# Altium project CWRUMagEncoder.PrjPcb
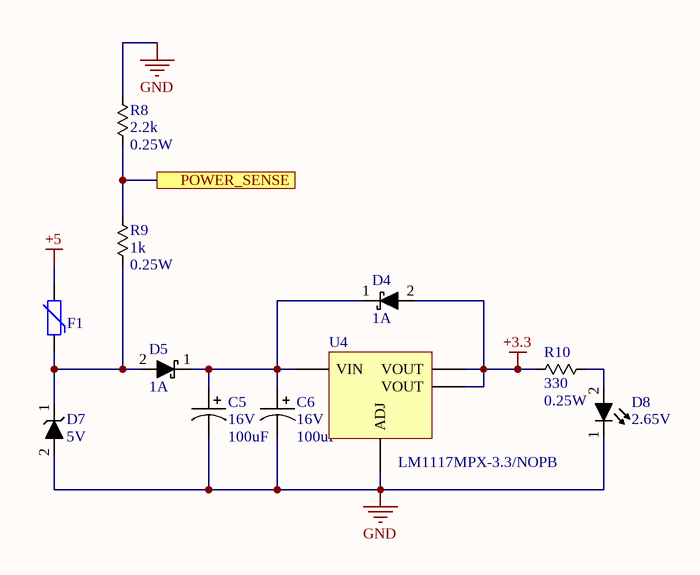
[diagram p0: Power.SchDoc]
4 sheets, 45 parts. Net scope: flat (ports and power ports of the same name join across sheets).
Board file: Board.PcbDoc
Sheets:
  Power.SchDoc
  IO.SchDoc
  Encoder.SchDoc
  MCU.SchDoc

## Sheet Power.SchDoc
size A

### Parts
C5  Voltage Rating: 16V  Capacitance: 100uF  [chip_2917_AVX_TAJD]  (hidden comment: cap_single_p)
C6  Voltage Rating: 16V  Capacitance: 100uF  [chip_2917_AVX_TAJD]  (hidden comment: cap_single_p)
D4  Current Rating: 1A  [sod123_0]  (hidden comment: diode_2)
D5  Current Rating: 1A  [sod123_0]  (hidden comment: diode_2)
D7  Reverse Breakdown Voltage: 5V  [do-214ac]  (hidden comment: diode_1)
D8  Forward Voltage: 2.65V  [chip_0603]  (hidden comment: diode_4)
F1  PTC_0  [chip_1206]  (value not drawn)
R8  Resistance: 2.2k  Power Rating: 0.25W  [chip_0603]  (hidden comment: res_single)
R9  Resistance: 1k  Power Rating: 0.25W  [chip_0603]  (hidden comment: res_single)
R10  Resistance: 330  Power Rating: 0.25W  [chip_0603]  (hidden comment: res_single)
U4  Manufacturer PN: LM1117MPX-3.3/NOPB  [sot-223-4]  (hidden comment: LM1117)

### Ports
POWER_SENSE

### Nets
+3.3: D4.2 R10.1 U4.2(VOUT) U4.4(VOUT)
+5: F1.2
GND: C5.2 C6.2 D7.2 D8.1 R8.1 U4.1(ADJ)
NetC5_1: C5.1 C6.1 D4.1 D5.1 U4.3(VIN)
NetD5_2: D5.2 D7.1 F1.1 R9.2
NetD8_2: D8.2 R10.2
NetR8_2: R8.2 R9.1 ; port POWER_SENSE

### Library data of the parts
C5 C6 = CAP-00550: CAP, 100uF, ±10%, 16V, Tantalum, 2917; Manufacturer: AVX; Manufacturer PN: TAJD107K016RNJ; Tolerance: ±10%; Part Number: CAP-00550; Type: Tantalum; Cost: $0.94
D4 D5 = DIO-00001: Dio Shtky, 1A, 0.55V, 40V, SOD-123; Manufacturer: ON Semi; Manufacturer PN: MBR140SFT1G; Forward Voltage: 550mV; Type: Schottky; Reverse Breakdown Voltage: 40V; Part Number: DIO-00001
D7 = DIO-00036: TVS, 5V, 400W, Unidirectional; Manufacturer: ST; Manufacturer PN: SMAJ5.0A-TR; Type: TVS; Part Number: DIO-00036; Power Rating: 400W; Cost: 0.48
D8 = DIO-00050: LED, Green, 0603, Low current, HELI2 Series; Manufacturer: Kingbright; Manufacturer PN: APT1608LZGCK; Reverse Breakdown Voltage: 5V; Current Rating: 30mA; Power Rating: 120mW; Type: LED; Part Number: DIO-00050; Cost: 0.58
F1 = MISC-00008: PTC Resettable fuse, 6V, 500mA, 1206; Manufacturer: Eaton; Manufacturer PN: PTS12066V050; TEMP_CO: *; Part Number: MISC-00008; Cost: 0.3
R8 = RES-00365: RES SMD 2.2K OHM 1% 1/4W 0603; Manufacturer: Panasonic; Manufacturer PN: ERJ-PA3F2201V; Tolerance: 1%; Part Number: RES-00365
R9 = RES-00360: RES SMD 1K OHM 1% 1/4W 0603; Manufacturer: Panasonic; Manufacturer PN: ERJ-PA3F1001V; Tolerance: 1%; Part Number: RES-00360
R10 = RES-00221: RES SMD 330 OHM 1% 1/4W 0603; Manufacturer: Panasonic; Manufacturer PN: ERJ-PA3F3300V; Tolerance: 1%; Part Number: RES-00221
U4 = PWREG-00018: REG, Linear, Fixed 3V3, 800mA, SOT-223; Manufacturer: TI; Voltage Range In: 4.5 - 15V; Voltage Range Out: 3.3V; Part Number: PWREG-00018; Max Current: 800mA; Reg Type: Linear; Fixed/Adj: Fixed; Cost: 1.14

## Sheet IO.SchDoc
size A
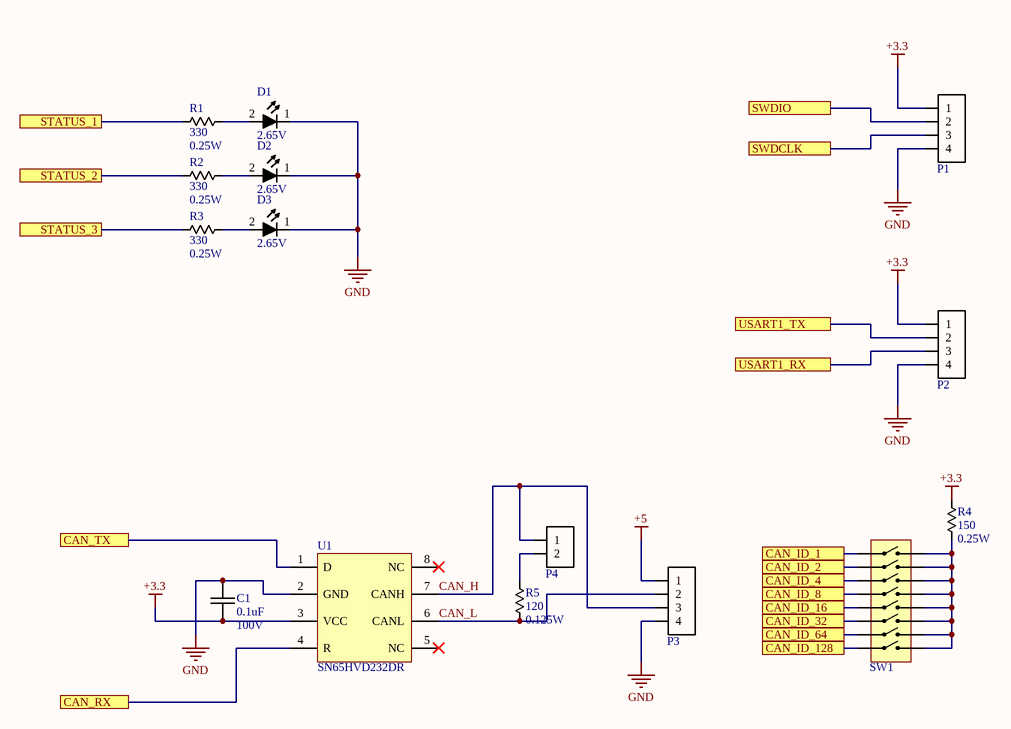
[diagram p1: IO.SchDoc]

### Parts
C1  Capacitance: 0.1uF  Voltage Rating: 100V  [chip_0603]  (hidden comment: cap_single_np)
D1  Forward Voltage: 2.65V  [chip_0603]  (hidden comment: diode_4)
D2  Forward Voltage: 2.65V  [chip_0603]  (hidden comment: diode_4)
D3  Forward Voltage: 2.65V  [chip_0603]  (hidden comment: diode_4)
P1  conn-4x1_0  [HDDR_4x1_0]  (value not drawn)
P2  conn-4x1_0  [HDDR_4x1_0]  (value not drawn)
P3  conn-4x1_0  [TERM_3.50MM_4x1_0]  (value not drawn)
P4  conn-2x1_0  [hddr_2x1_0]  (value not drawn)
R1  Resistance: 330  Power Rating: 0.25W  [chip_0603]  (hidden comment: res_single)
R2  Resistance: 330  Power Rating: 0.25W  [chip_0603]  (hidden comment: res_single)
R3  Resistance: 330  Power Rating: 0.25W  [chip_0603]  (hidden comment: res_single)
R4  Resistance: 150  Power Rating: 0.25W  [chip_0603]  (hidden comment: res_single)
R5  Resistance: 120  Power Rating: 0.125W  [chip_0805]  (hidden comment: res_single)
SW1  DIP_SW_8  [A6S-8104-H]  (value not drawn)
U1  Manufacturer PN: SN65HVD232DR  [SO-8]  (hidden comment: SN65HVD232)

### Ports
CAN_ID_1, CAN_ID_2, CAN_ID_4, CAN_ID_8, CAN_ID_16, CAN_ID_32, CAN_ID_64, CAN_ID_128, CAN_RX, CAN_TX, STATUS_1, STATUS_2, STATUS_3, SWDCLK, SWDIO, USART1_RX, USART1_TX

### Nets
+3.3: C1.2 P1.1 P2.1 R4.2 U1.3(VCC)
+5: P3.1
GND: C1.1 D1.1 D2.1 D3.1 P1.4 P2.4 P3.4 U1.2(GND)
CAN_H: P3.3 P4.1 U1.7(CANH)
CAN_L: P3.2 R5.2 U1.6(CANL)
NetD1_2: D1.2 R1.2
NetD2_2: D2.2 R2.2
NetD3_2: D3.2 R3.2
NetP1_2: P1.2 ; port SWDIO
NetP1_3: P1.3 ; port SWDCLK
NetP2_2: P2.2 ; port USART1_TX
NetP2_3: P2.3 ; port USART1_RX
NetP4_2: P4.2 R5.1
NetR1_1: R1.1 ; port STATUS_1
NetR2_1: R2.1 ; port STATUS_2
NetR3_1: R3.1 ; port STATUS_3
NetR4_1: R4.1 SW1.9 SW1.10 SW1.11 SW1.12 SW1.13 SW1.14 SW1.15 SW1.16
NetSW1_1: SW1.1 ; port CAN_ID_1
NetSW1_2: SW1.2 ; port CAN_ID_2
NetSW1_3: SW1.3 ; port CAN_ID_4
NetSW1_4: SW1.4 ; port CAN_ID_8
NetSW1_5: SW1.5 ; port CAN_ID_16
NetSW1_6: SW1.6 ; port CAN_ID_32
NetSW1_7: SW1.7 ; port CAN_ID_64
NetSW1_8: SW1.8 ; port CAN_ID_128
NetU1_1: U1.1(D) ; port CAN_TX
NetU1_4: U1.4(R) ; port CAN_RX

Not connected (* = marked no-connect by the designer): U1 5(NC)* 8(NC)*

### Library data of the parts
C1 = CAP-00477: CAP, 0.1uF, ±10%, 100V, X7R, 0603; Manufacturer: Murata; Manufacturer PN: GRM188R72A104KA35D; Tolerance: ±10%; Part Number: CAP-00477; Type: X7R
D1-D3 = DIO-00049: LED, Blue, 0603, Low current, HELI2 Series; Manufacturer: Kingbright; Manufacturer PN: APT1608LVBC/D; Reverse Breakdown Voltage: 5V; Current Rating: 30mA; Power Rating: 120mW; Type: LED; Part Number: DIO-00049; Cost: 0.58
P1 P2 = CONN-00029: Header 4x1, 0.1"; Positions per level: 4; Levels: 1; Part Number: CONN-00029; Type: Header
P3 = CONN-00024: Term Blk, 4 Pos, 16A, 3.5mm Pitch; Manufacturer: Phoenix Contact; Manufacturer PN: 1861959; Positions per level: 4; Levels: 1; Current: 16; Part Number: CONN-00024; Type: Terminal Block; Cost: 1.67
P4 = CONN-00055: Header, 2x1, 0.1"; Manufacturer: Samtec; Manufacturer PN: TSW-102-07-F-S; Positions per level: 2; Levels: 1; Part Number: CONN-00055; Type: Header; Cost: 0.2
R1-R3 = RES-00221: as R10 on sheet Power; Tolerance: 1%; Part Number: RES-00221
R4 = RES-00188: RES SMD 150 OHM 1% 1/4W 0603; Manufacturer: Panasonic; Manufacturer PN: ERJ-PA3F1500V; Tolerance: 1%; Part Number: RES-00188
R5 = RES-00183: RES SMD 120 OHM 1% 1/8W 0805; Manufacturer: Rohm Semiconductor; Manufacturer PN: KTR10EZPF1200; Tolerance: 1%; Part Number: RES-00183
SW1 = MISC-00045: DIP Switch, 8 Switches, SMD, 25mA, 24V; Manufacturer: Omron; Manufacturer PN: A6S-8104-H; Part Number: MISC-00045; Cost: 2.85
U1 = IFACE-00008: CANbus Transceiver, Single channel, SN65HVD232; Manufacturer: TI; Part Number: IFACE-00008; Cost: 2.01

## Sheet Encoder.SchDoc
size A
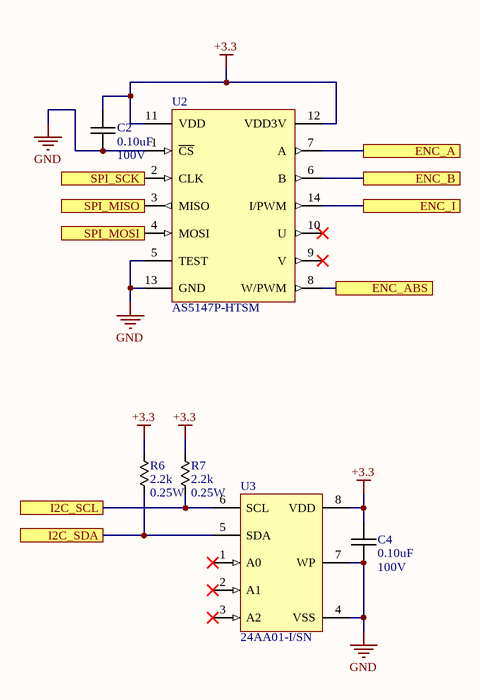
[diagram p2: Encoder.SchDoc]

### Parts
C2  Capacitance: 0.10uF  Voltage Rating: 100V  [chip_0805]  (hidden comment: cap_single_np)
C4  Capacitance: 0.10uF  Voltage Rating: 100V  [chip_0805]  (hidden comment: cap_single_np)
R6  Resistance: 2.2k  Power Rating: 0.25W  [chip_0603]  (hidden comment: res_single)
R7  Resistance: 2.2k  Power Rating: 0.25W  [chip_0603]  (hidden comment: res_single)
U2  AS5147P-HTSM  [TSSOP-14_0]
U3  Manufacturer PN: 24AA01-I/SN  [SO-8]  (hidden comment: 24AA01)

### Ports
ENC_A, ENC_ABS, ENC_B, ENC_I, I2C_SCL, I2C_SDA, SPI_MISO, SPI_MOSI, SPI_SCK

### Nets
+3.3: C2.1 C4.1 R6.1 R7.1 U2.11(VDD) U2.12(VDD3V) U3.8(VDD)
GND: C2.2 C4.2 U2.1(~{CS}) U2.5(TEST) U2.13(GND) U3.4(VSS) U3.7(WP)
NetR6_2: R6.2 U3.5(SDA) ; port I2C_SDA
NetR7_2: R7.2 U3.6(SCL) ; port I2C_SCL
NetU2_2: U2.2(CLK) ; port SPI_SCK
NetU2_3: U2.3(MISO) ; port SPI_MISO
NetU2_4: U2.4(MOSI) ; port SPI_MOSI
NetU2_6: U2.6(B) ; port ENC_B
NetU2_7: U2.7(A) ; port ENC_A
NetU2_8: U2.8(W/PWM) ; port ENC_ABS
NetU2_14: U2.14(I/PWM) ; port ENC_I

Not connected (* = marked no-connect by the designer): U2 9(V)* 10(U)*; U3 1(A0)* 2(A1)* 3(A2)*

### Library data of the parts
C2 C4 = CAP-00073: CAP, 0.10uF, 10%, 100V, X7R, 0805; Manufacturer: Murata; Manufacturer PN: GRM21BR72A104KAC4L; Tolerance: 10%; Part Number: CAP-00073; Type: X7R
R6 R7 = RES-00365: as R8 on sheet Power; Tolerance: 1%; Part Number: RES-00365
U2 = MISC-00046: IC, 14-bit On-Axis Magnetic Rotary Position Sensor, Incremental, TSSOP-14; Manufacturer: AMS; Part Number: MISC-00046; Manufacturer PN: AS5147P-HTSM; Cost: 12.23
U3 = LOGIC-00028: EEPROM, 1K-bit, I2C, 400kHz, 24AA01, 8-SOIC; Manufacturer: Microchip; Part Number: LOGIC-00028; Cost: $0.20

## Sheet MCU.SchDoc
size A
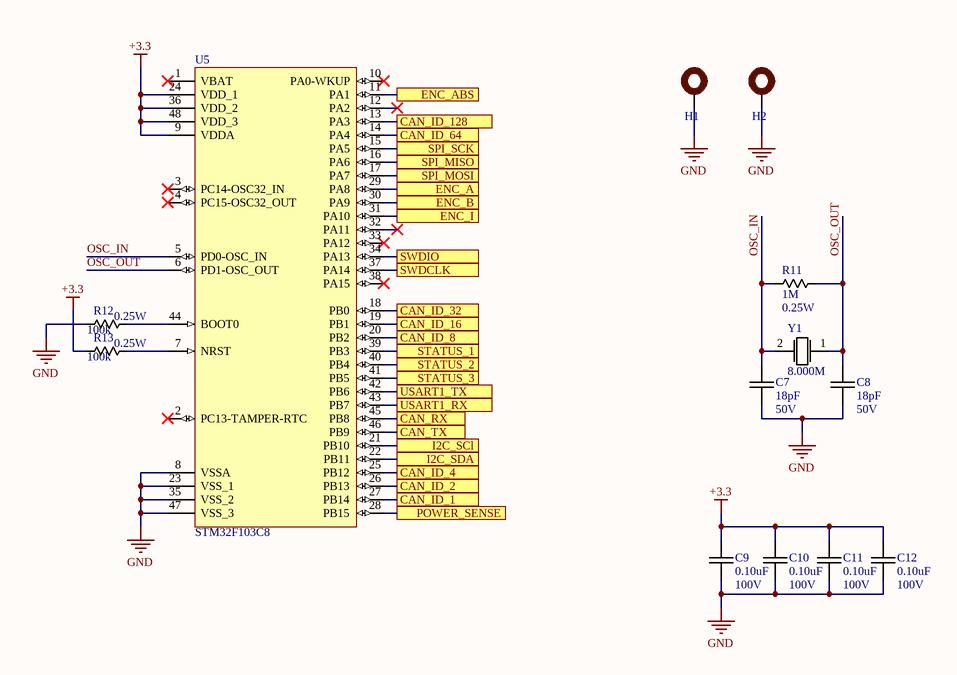
[diagram p3: MCU.SchDoc]

### Parts
C7  Capacitance: 18pF  Voltage Rating: 50V  [chip_0603]  (hidden comment: cap_single_np)
C8  Capacitance: 18pF  Voltage Rating: 50V  [chip_0603]  (hidden comment: cap_single_np)
C9  Capacitance: 0.10uF  Voltage Rating: 100V  [chip_0805]  (hidden comment: cap_single_np)
C10  Capacitance: 0.10uF  Voltage Rating: 100V  [chip_0805]  (hidden comment: cap_single_np)
C11  Capacitance: 0.10uF  Voltage Rating: 100V  [chip_0805]  (hidden comment: cap_single_np)
C12  Capacitance: 0.10uF  Voltage Rating: 100V  [chip_0805]  (hidden comment: cap_single_np)
H1  mounting_hole_0  [#8-32_SOCKET_HEAD]  (value not drawn)
H2  mounting_hole_0  [#8-32_SOCKET_HEAD]  (value not drawn)
R11  Resistance: 1M  Power Rating: 0.25W  [chip_0603]  (hidden comment: res_single)
R12  Resistance: 100k  Power Rating: 0.25W  [chip_0603]  (hidden comment: res_single)
R13  Resistance: 100k  Power Rating: 0.25W  [chip_0603]  (hidden comment: res_single)
U5  STM32F103C8  [LQFP48_0]
Y1  Frequency: 8.000M  [ABLS_AT49_OSC]  (hidden comment: osc_xtal_2p_0)

### Ports
CAN_ID_1, CAN_ID_2, CAN_ID_4, CAN_ID_8, CAN_ID_16, CAN_ID_32, CAN_ID_64, CAN_ID_128, CAN_RX, CAN_TX, ENC_A, ENC_ABS, ENC_B, ENC_I, I2C_SCl, I2C_SDA, POWER_SENSE, SPI_MISO, SPI_MOSI, SPI_SCK, STATUS_1, STATUS_2, STATUS_3, SWDCLK, SWDIO, USART1_RX, USART1_TX

### Nets
+3.3: C9.1 C10.1 C11.1 C12.1 R13.2 U5.9(VDDA) U5.24(VDD_1) U5.36(VDD_2) U5.48(VDD_3)
GND: C7.2 C8.2 C9.2 C10.2 C11.2 C12.2 H1.0(A) H2.0(A) R12.2 U5.8(VSSA) U5.23(VSS_1) U5.35(VSS_2) U5.47(VSS_3)
OSC_IN: C7.1 R11.1 U5.5(PD0-OSC_IN) Y1.2
OSC_OUT: C8.1 R11.2 U5.6(PD1-OSC_OUT) Y1.1
NetP1_2: U5.34(PA13) ; port SWDIO
NetP1_3: U5.37(PA14) ; port SWDCLK
NetP2_2: U5.42(PB6) ; port USART1_TX
NetP2_3: U5.43(PB7) ; port USART1_RX
NetR1_1: U5.39(PB3) ; port STATUS_1
NetR2_1: U5.40(PB4) ; port STATUS_2
NetR3_1: U5.41(PB5) ; port STATUS_3
NetR6_2: U5.22(PB11) ; port I2C_SDA
NetR7_2: U5.21(PB10) ; port I2C_SCl
NetR8_2: U5.28(PB15) ; port POWER_SENSE
NetR12_1: R12.1 U5.44(BOOT0)
NetR13_1: R13.1 U5.7(NRST)
NetSW1_1: U5.27(PB14) ; port CAN_ID_1
NetSW1_2: U5.26(PB13) ; port CAN_ID_2
NetSW1_3: U5.25(PB12) ; port CAN_ID_4
NetSW1_4: U5.20(PB2) ; port CAN_ID_8
NetSW1_5: U5.19(PB1) ; port CAN_ID_16
NetSW1_6: U5.18(PB0) ; port CAN_ID_32
NetSW1_7: U5.14(PA4) ; port CAN_ID_64
NetSW1_8: U5.13(PA3) ; port CAN_ID_128
NetU1_1: U5.46(PB9) ; port CAN_TX
NetU1_4: U5.45(PB8) ; port CAN_RX
NetU2_2: U5.15(PA5) ; port SPI_SCK
NetU2_3: U5.16(PA6) ; port SPI_MISO
NetU2_4: U5.17(PA7) ; port SPI_MOSI
NetU2_6: U5.30(PA9) ; port ENC_B
NetU2_7: U5.29(PA8) ; port ENC_A
NetU2_8: U5.11(PA1) ; port ENC_ABS
NetU2_14: U5.31(PA10) ; port ENC_I

Not connected (* = marked no-connect by the designer): U5 1(VBAT)* 2(PC13-TAMPER-RTC)* 3(PC14-OSC32_IN)* 4(PC15-OSC32_OUT)* 10(PA0-WKUP)* 12(PA2)* 32(PA11)* 33(PA12)* 38(PA15)*

### Library data of the parts
C7 C8 = CAP-00417: CAP, 18pF, ±1%, 50V, C0G, 0603; Manufacturer: Murata; Manufacturer PN: GRM1885C1H180FA01J; Tolerance: ±1%; Part Number: CAP-00417; Type: C0G
C9-C12 = CAP-00073: as C2 on sheet Encoder; Tolerance: 10%; Part Number: CAP-00073; Type: X7R
H1 H2 = MISC-00027: #8-32 Mounting Hole for Socket Head Cap Screw; Part Number: MISC-00027
R11 = RES-00362: RES SMD 1M OHM 1% 1/4W 0603; Manufacturer: Panasonic; Manufacturer PN: ERJ-PA3F1004V; Tolerance: 1%; Part Number: RES-00362
R12 R13 = RES-00301: RES SMD 100K OHM 1% 1/4W 0603; Manufacturer: Panasonic; Manufacturer PN: ERJ-PA3F1003V; Tolerance: 1%; Part Number: RES-00301
U5 = UCTRL-00008: STM32 M3, LQFP-48; Manufacturer: ST; Manufacturer PN: STM32F103C8; Part Number: UCTRL-00008
Y1 = OSC-00002: XTAL, 8MHz, 18pF, 20ppm; Manufacturer: Abracon; Manufacturer PN: ABLS-8.000MHZ-B2-T; ESR: 80; Stability: 50ppm; Load Capacitance: 18pF; Tolerance: 20ppm; Part Number: OSC-00002

## Nets that join several sheets
+3.3: Power (D4.2 R10.1 U4.2 U4.4), IO (5 pins), Encoder (7 pins), MCU (9 pins)
+5: Power (F1.2), IO (P3.1)
GND: Power (6 pins), IO (8 pins), Encoder (7 pins), MCU (13 pins)
NetP1_2: IO (P1.2), MCU (U5.34)
NetP1_3: IO (P1.3), MCU (U5.37)
NetP2_2: IO (P2.2), MCU (U5.42)
NetP2_3: IO (P2.3), MCU (U5.43)
NetR1_1: IO (R1.1), MCU (U5.39)
NetR2_1: IO (R2.1), MCU (U5.40)
NetR3_1: IO (R3.1), MCU (U5.41)
NetR6_2: Encoder (R6.2 U3.5), MCU (U5.22)
NetR7_2: Encoder (R7.2 U3.6), MCU (U5.21)
NetR8_2: Power (R8.2 R9.1), MCU (U5.28)
NetSW1_1: IO (SW1.1), MCU (U5.27)
NetSW1_2: IO (SW1.2), MCU (U5.26)
NetSW1_3: IO (SW1.3), MCU (U5.25)
NetSW1_4: IO (SW1.4), MCU (U5.20)
NetSW1_5: IO (SW1.5), MCU (U5.19)
NetSW1_6: IO (SW1.6), MCU (U5.18)
NetSW1_7: IO (SW1.7), MCU (U5.14)
NetSW1_8: IO (SW1.8), MCU (U5.13)
NetU1_1: IO (U1.1), MCU (U5.46)
NetU1_4: IO (U1.4), MCU (U5.45)
NetU2_2: Encoder (U2.2), MCU (U5.15)
NetU2_3: Encoder (U2.3), MCU (U5.16)
NetU2_4: Encoder (U2.4), MCU (U5.17)
NetU2_6: Encoder (U2.6), MCU (U5.30)
NetU2_7: Encoder (U2.7), MCU (U5.29)
NetU2_8: Encoder (U2.8), MCU (U5.11)
NetU2_14: Encoder (U2.14), MCU (U5.31)